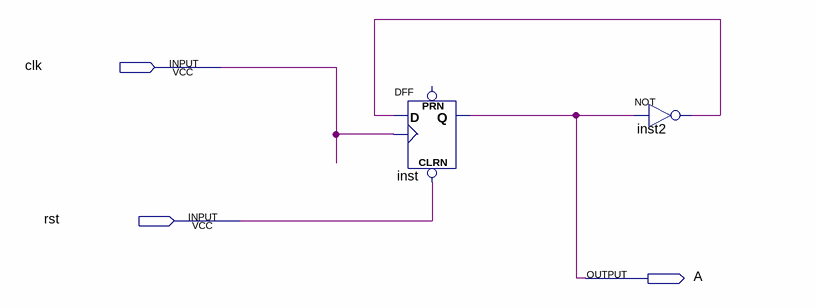
[diagram p0: schematic sheet]
// Quartus schematic count_2.bdf as structural Verilog: 2 symbols, 3 pins
module count_2 (
  input  clk,
  input  rst,
  output A
);

  wire inst2_out;

  DFF inst (.CLRN(rst), .CLK(clk), .D(inst2_out), .Q(A));  // open: PRN
  not inst2 (inst2_out, A);
endmodule
